# Altium schematic sheet ENET.SchDoc: ENET PHY
size 431 x 279 mm; Author: Shivam Sharma; SheetNumber: 4; SheetTotal: 14; SheetRevision: 1.0
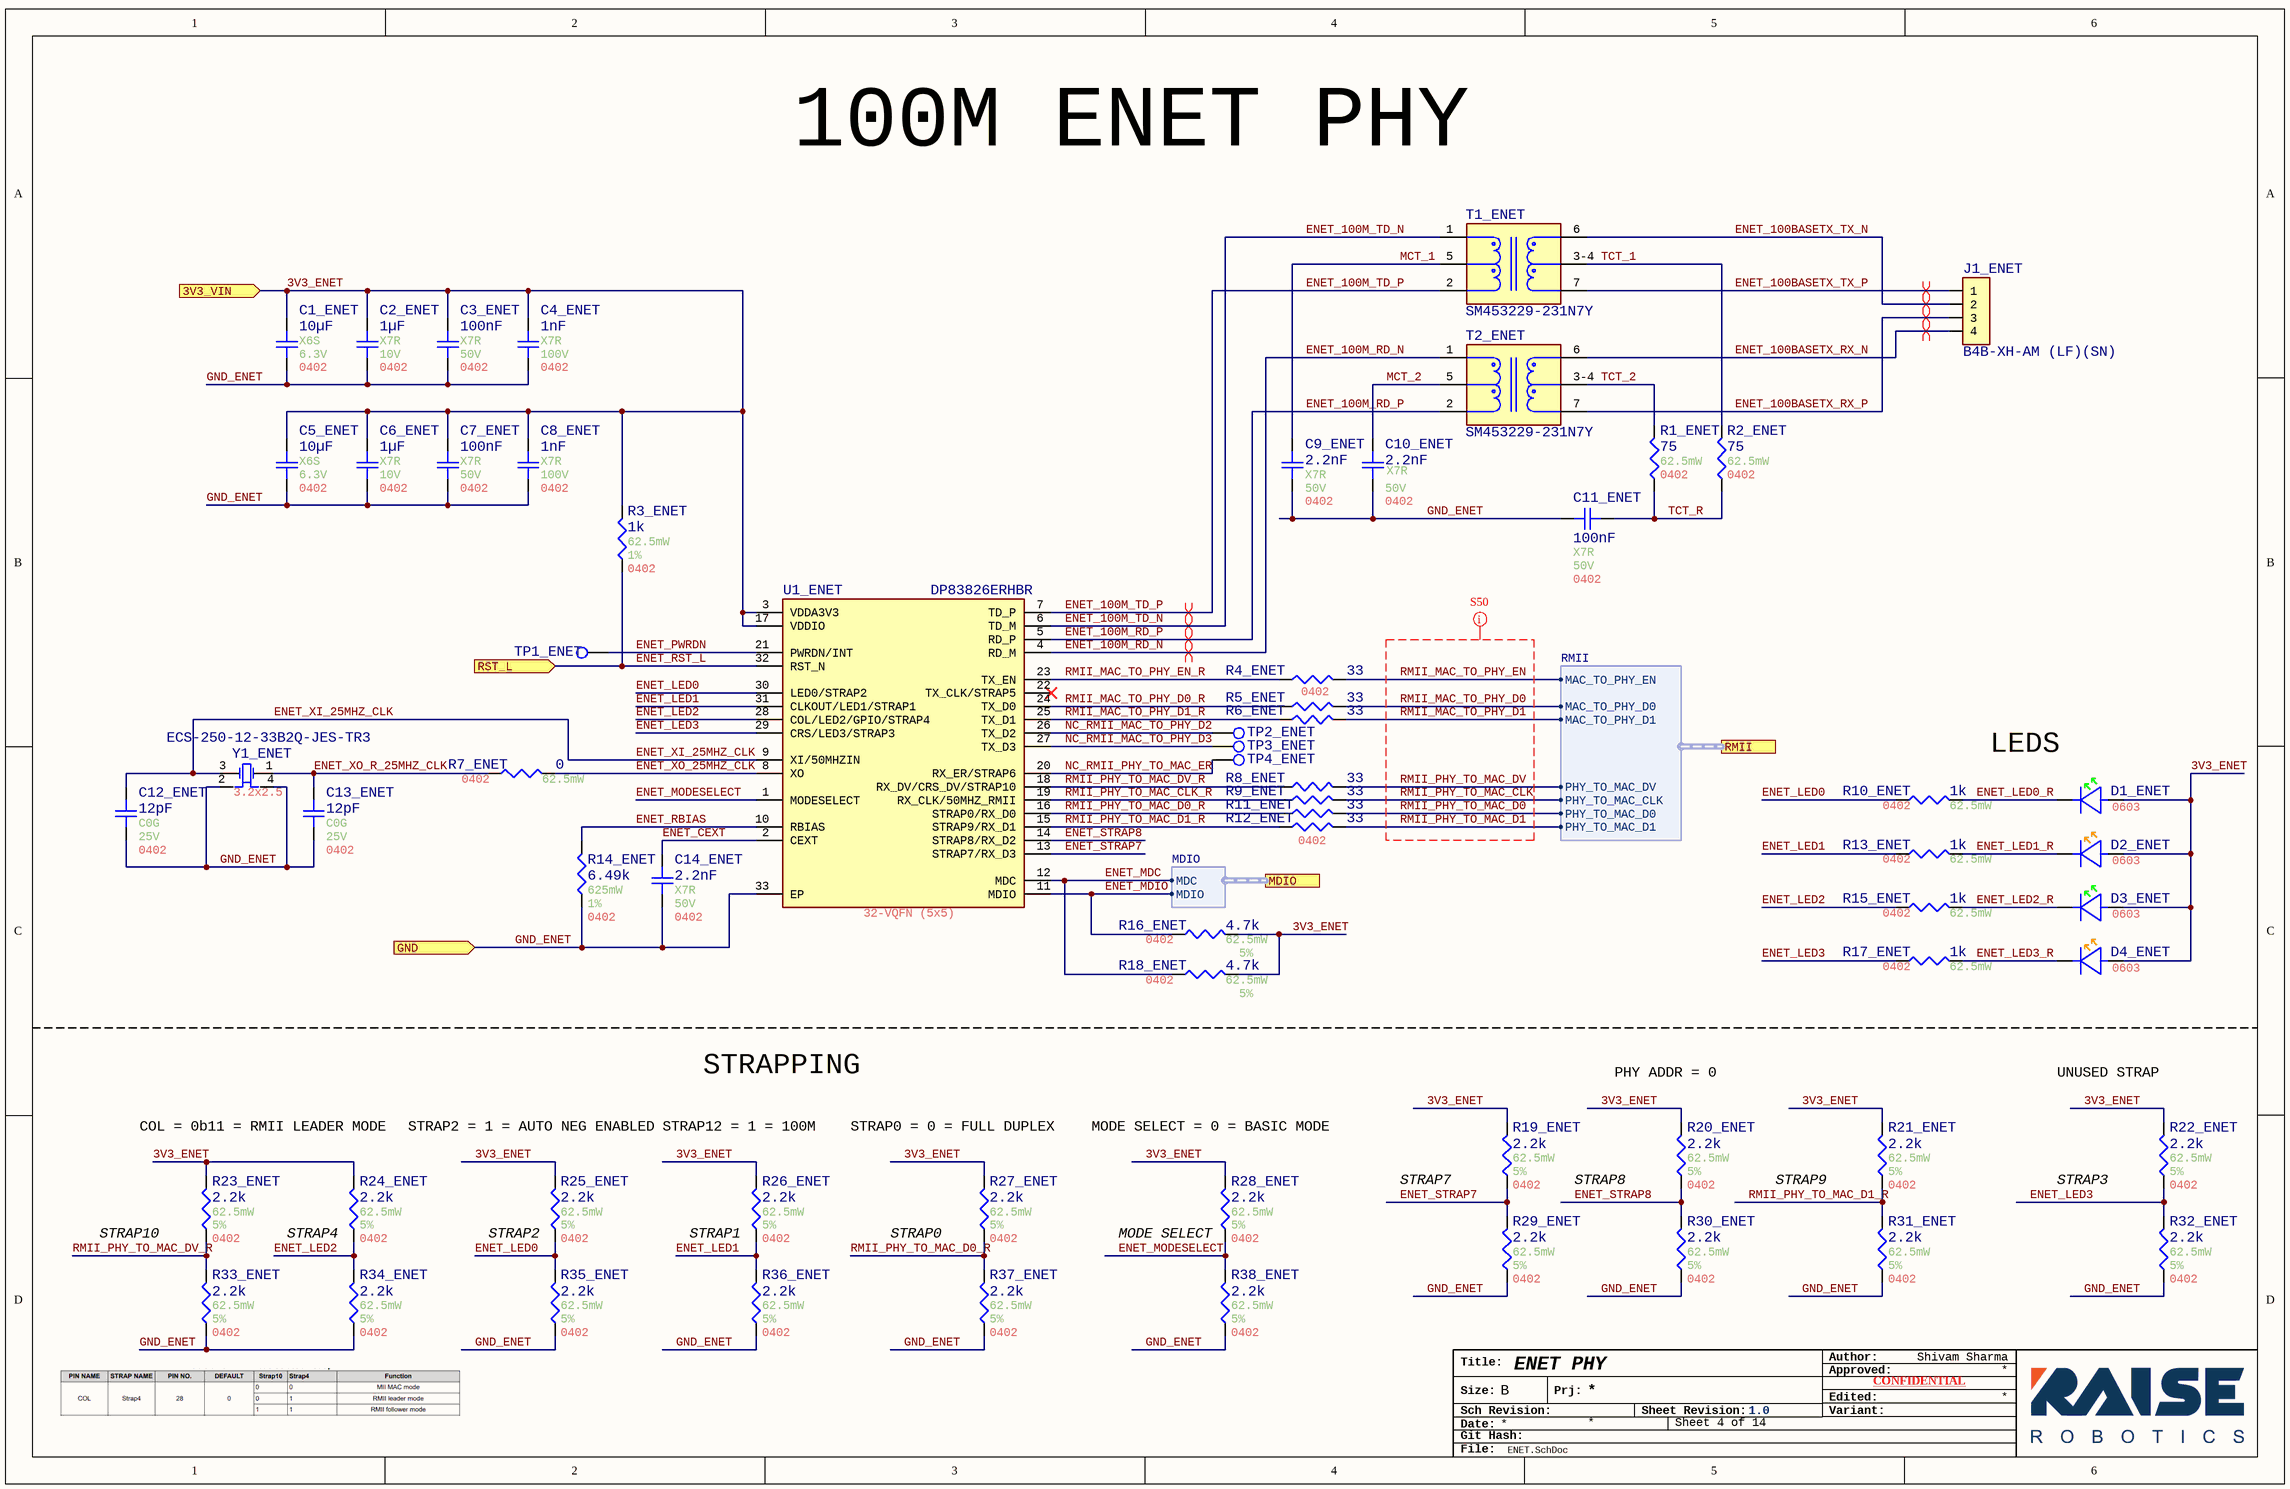
[diagram p0: ENET.SchDoc]

## Parts
C1_ENET  value 10µF  Temperature Coefficient: X6S  Voltage Rating: 6.3V  Case/Package: 0402  [Generic 0402 capacitor]  (hidden comment: GRT155C80J106ME13J)
C2_ENET  value 1µF  Temperature Coefficient: X7R  Voltage Rating: 10V  Case/Package: 0402  [Generic 0402 capacitor]  (hidden comment: MAASL105CD7105MFCA01)
C3_ENET  value 100nF  Temperature Coefficient: X7R  Voltage Rating: 50V  Case/Package: 0402  [Generic 0402 capacitor]  (hidden comment: GRT155R71H104KE01D)
C4_ENET  value 1nF  Temperature Coefficient: X7R  Voltage Rating: 100V  Case/Package: 0402  [Generic 0402 capacitor]  (hidden comment: GCM155R72A102KA37J)
C5_ENET  value 10µF  Temperature Coefficient: X6S  Voltage Rating: 6.3V  Case/Package: 0402  [Generic 0402 capacitor]  (hidden comment: GRT155C80J106ME13J)
C6_ENET  value 1µF  Temperature Coefficient: X7R  Voltage Rating: 10V  Case/Package: 0402  [Generic 0402 capacitor]  (hidden comment: MAASL105CD7105MFCA01)
C7_ENET  value 100nF  Temperature Coefficient: X7R  Voltage Rating: 50V  Case/Package: 0402  [Generic 0402 capacitor]  (hidden comment: GRT155R71H104KE01D)
C8_ENET  value 1nF  Temperature Coefficient: X7R  Voltage Rating: 100V  Case/Package: 0402  [Generic 0402 capacitor]  (hidden comment: GCM155R72A102KA37J)
C9_ENET  value 2.2nF  Temperature Coefficient: X7R  Voltage Rating: 50V  Case/Package: 0402  [Generic 0402 capacitor]  (hidden comment: CGA2B2X7R1H222K050BA)
C10_ENET  value 2.2nF  Temperature Coefficient: X7R  Voltage Rating: 50V  Case/Package: 0402  [Generic 0402 capacitor]  (hidden comment: CGA2B2X7R1H222K050BA)
C11_ENET  value 100nF  Temperature Coefficient: X7R  Voltage Rating: 50V  Case/Package: 0402  [Generic 0402 capacitor]  (hidden comment: GRT155R71H104KE01D)
C12_ENET  value 12pF  Temperature Coefficient: C0G  Voltage Rating: 25V  Case/Package: 0402  [Generic 0402 capacitor]  (hidden comment: GRT1555C1E120JA02J)
C13_ENET  value 12pF  Temperature Coefficient: C0G  Voltage Rating: 25V  Case/Package: 0402  [Generic 0402 capacitor]  (hidden comment: GRT1555C1E120JA02J)
C14_ENET  value 2.2nF  Temperature Coefficient: X7R  Voltage Rating: 50V  Case/Package: 0402  [Generic 0402 capacitor]  (hidden comment: CGA2B2X7R1H222K050BA)
D1_ENET  Case/Package: 0603  [SML-D12P8WT86C]  (hidden comment: SML-D12P8WT86C)
D2_ENET  Case/Package: 0603  [FP-SML-D12-MFG]  (hidden comment: SML-D12D8WT86C)
D3_ENET  Case/Package: 0603  [SML-D12P8WT86C]  (hidden comment: SML-D12P8WT86C)
D4_ENET  Case/Package: 0603  [FP-SML-D12-MFG]  (hidden comment: SML-D12D8WT86C)
J1_ENET  B4B-XH-AM (LF)(SN)  [FP-B4B-XH-AM_LF_SN-MFG]
R1_ENET  value 75  Power: 62.5mW  Case/Package: 0402  [Generic 0402 Resistor]  (hidden comment: WR04X75R0FTL)
R2_ENET  value 75  Power: 62.5mW  Case/Package: 0402  [Generic 0402 Resistor]  (hidden comment: WR04X75R0FTL)
R3_ENET  value 1k  Power: 62.5mW  Tolerance: 1%  Case/Package: 0402  [Generic 0402 Resistor]  (hidden comment: WR04X1001FTL)
R4_ENET  value 33  [Generic 0402 Resistor]  (hidden comment: RMCA0402FT33R0-HP)
R5_ENET  value 33  [Generic 0402 Resistor]  (hidden comment: RMCA0402FT33R0-HP)
R6_ENET  value 33  Case/Package: 0402  [Generic 0402 Resistor]  (hidden comment: RMCA0402FT33R0-HP)
R7_ENET  value 0  Power: 62.5mW  Case/Package: 0402  [Generic 0402 Resistor]  (hidden comment: WR04X000PTL)
R8_ENET  value 33  [Generic 0402 Resistor]  (hidden comment: RMCA0402FT33R0-HP)
R9_ENET  value 33  [Generic 0402 Resistor]  (hidden comment: RMCA0402FT33R0-HP)
R10_ENET  value 1k  Power: 62.5mW  Case/Package: 0402  [Generic 0402 Resistor]  (hidden comment: WR04X1001FTL)
R11_ENET  value 33  [Generic 0402 Resistor]  (hidden comment: RMCA0402FT33R0-HP)
R12_ENET  value 33  Case/Package: 0402  [Generic 0402 Resistor]  (hidden comment: RMCA0402FT33R0-HP)
R13_ENET  value 1k  Power: 62.5mW  Case/Package: 0402  [Generic 0402 Resistor]  (hidden comment: WR04X1001FTL)
R14_ENET  value 6.49k  Power: 625mW  Tolerance: 1%  Case/Package: 0402  [Generic 0402 Resistor]  (hidden comment: AC0402FR-076K49L)
R15_ENET  value 1k  Power: 62.5mW  Case/Package: 0402  [Generic 0402 Resistor]  (hidden comment: WR04X1001FTL)
R16_ENET  value 4.7k  Power: 62.5mW  Tolerance: 5%  Case/Package: 0402  [Generic 0402 Resistor]  (hidden comment: WR04X472JTL)
R17_ENET  value 1k  Power: 62.5mW  Case/Package: 0402  [Generic 0402 Resistor]  (hidden comment: WR04X1001FTL)
R18_ENET  value 4.7k  Power: 62.5mW  Tolerance: 5%  Case/Package: 0402  [Generic 0402 Resistor]  (hidden comment: WR04X472JTL)
R19_ENET  value 2.2k  Power: 62.5mW  Tolerance: 5%  Case/Package: 0402  [Generic 0402 Resistor]  (hidden comment: CR0402-JW-222GLF)
R20_ENET  value 2.2k  Power: 62.5mW  Tolerance: 5%  Case/Package: 0402  [Generic 0402 Resistor]  (hidden comment: CR0402-JW-222GLF)
R21_ENET  value 2.2k  Power: 62.5mW  Tolerance: 5%  Case/Package: 0402  [Generic 0402 Resistor]  (hidden comment: CR0402-JW-222GLF)
R22_ENET  value 2.2k  Power: 62.5mW  Tolerance: 5%  Case/Package: 0402  [Generic 0402 Resistor]  (hidden comment: CR0402-JW-222GLF)
R23_ENET  value 2.2k  Power: 62.5mW  Tolerance: 5%  Case/Package: 0402  [Generic 0402 Resistor]  (hidden comment: CR0402-JW-222GLF)
R24_ENET  value 2.2k  Power: 62.5mW  Tolerance: 5%  Case/Package: 0402  [Generic 0402 Resistor]  (hidden comment: CR0402-JW-222GLF)
R25_ENET  value 2.2k  Power: 62.5mW  Tolerance: 5%  Case/Package: 0402  [Generic 0402 Resistor]  (hidden comment: CR0402-JW-222GLF)
R26_ENET  value 2.2k  Power: 62.5mW  Tolerance: 5%  Case/Package: 0402  [Generic 0402 Resistor]  (hidden comment: CR0402-JW-222GLF)
R27_ENET  value 2.2k  Power: 62.5mW  Tolerance: 5%  Case/Package: 0402  [Generic 0402 Resistor]  (hidden comment: CR0402-JW-222GLF)
R28_ENET  value 2.2k  Power: 62.5mW  Tolerance: 5%  Case/Package: 0402  [Generic 0402 Resistor]  (hidden comment: CR0402-JW-222GLF)
R29_ENET  value 2.2k  Power: 62.5mW  Tolerance: 5%  Case/Package: 0402  [Generic 0402 Resistor]  (hidden comment: CR0402-JW-222GLF)
R30_ENET  value 2.2k  Power: 62.5mW  Tolerance: 5%  Case/Package: 0402  [Generic 0402 Resistor]  (hidden comment: CR0402-JW-222GLF)
R31_ENET  value 2.2k  Power: 62.5mW  Tolerance: 5%  Case/Package: 0402  [Generic 0402 Resistor]  (hidden comment: CR0402-JW-222GLF)
R32_ENET  value 2.2k  Power: 62.5mW  Tolerance: 5%  Case/Package: 0402  [Generic 0402 Resistor]  (hidden comment: CR0402-JW-222GLF)
R33_ENET  value 2.2k  Power: 62.5mW  Tolerance: 5%  Case/Package: 0402  [Generic 0402 Resistor]  (hidden comment: CR0402-JW-222GLF)
R34_ENET  value 2.2k  Power: 62.5mW  Tolerance: 5%  Case/Package: 0402  [Generic 0402 Resistor]  (hidden comment: CR0402-JW-222GLF)
R35_ENET  value 2.2k  Power: 62.5mW  Tolerance: 5%  Case/Package: 0402  [Generic 0402 Resistor]  (hidden comment: CR0402-JW-222GLF)
R36_ENET  value 2.2k  Power: 62.5mW  Tolerance: 5%  Case/Package: 0402  [Generic 0402 Resistor]  (hidden comment: CR0402-JW-222GLF)
R37_ENET  value 2.2k  Power: 62.5mW  Tolerance: 5%  Case/Package: 0402  [Generic 0402 Resistor]  (hidden comment: CR0402-JW-222GLF)
R38_ENET  value 2.2k  Power: 62.5mW  Tolerance: 5%  Case/Package: 0402  [Generic 0402 Resistor]  (hidden comment: CR0402-JW-222GLF)
T1_ENET  SM453229-231N7Y  [SM453229-231N7Y]
T2_ENET  SM453229-231N7Y  [SM453229-231N7Y]
TP1_ENET  TP 0.75mm  [TP 0.75mm]  (value not drawn)  (no BOM)
TP2_ENET  TP 0.75mm  [TP 0.75mm]  (value not drawn)  (no BOM)
TP3_ENET  TP 0.75mm  [TP 0.75mm]  (value not drawn)  (no BOM)
TP4_ENET  TP 0.75mm  [TP 0.75mm]  (value not drawn)  (no BOM)
U1_ENET  DP83826ERHBR  Case/Package: 32-VQFN (5x5)  [DP83826ERHBR]
Y1_ENET  ECS-250-12-33B2Q-JES-TR3  Case/Package: 3.2x2.5  [ECS-250-12-33B2Q-JES-TR3]

## Ports
3V3_VIN (in), GND (in), MDIO (harness MDIO), RMII (harness RMII), RST_L (in)

## Harnesses
MDIO: MDIO, MDC
RMII: MAC_TO_PHY_D0, MAC_TO_PHY_D1, PHY_TO_MAC_D0, PHY_TO_MAC_CLK, PHY_TO_MAC_D1, MAC_TO_PHY_EN, PHY_TO_MAC_DV

## Nets
3V3_ENET: C1_ENET.2 C2_ENET.2 C3_ENET.2 C4_ENET.2 C5_ENET.2 C6_ENET.2 C7_ENET.2 C8_ENET.2 D1_ENET.2(A) D2_ENET.2(A) D3_ENET.2(A) D4_ENET.2(A) R3_ENET.2 R16_ENET.2 R18_ENET.2 R19_ENET.2 R20_ENET.2 R21_ENET.2 R22_ENET.2 R23_ENET.2 R24_ENET.2 R25_ENET.2 R26_ENET.2 R27_ENET.2 R28_ENET.2 U1_ENET.3(VDDA3V3) U1_ENET.17(VDDIO) ; port 3V3_VIN
ENET_100BASETX_RX_N: J1_ENET.4 T2_ENET.6
ENET_100BASETX_RX_P: J1_ENET.3 T2_ENET.7
ENET_100BASETX_TX_N: J1_ENET.2 T1_ENET.6
ENET_100BASETX_TX_P: J1_ENET.1 T1_ENET.7
ENET_100M_RD_N: T2_ENET.1 U1_ENET.4(RD_M)
ENET_100M_RD_P: T2_ENET.2 U1_ENET.5(RD_P)
ENET_100M_TD_N: T1_ENET.1 U1_ENET.6(TD_M)
ENET_100M_TD_P: T1_ENET.2 U1_ENET.7(TD_P)
ENET_CEXT: C14_ENET.2 U1_ENET.2(CEXT)
ENET_LED0: R10_ENET.1 R25_ENET.1 R35_ENET.2 U1_ENET.30(LED0/STRAP2)
ENET_LED0_R: D1_ENET.1(C) R10_ENET.2
ENET_LED1: R13_ENET.1 R26_ENET.1 R36_ENET.2 U1_ENET.31(CLKOUT/LED1/STRAP1)
ENET_LED1_R: D2_ENET.1(C) R13_ENET.2
ENET_LED2: R15_ENET.1 R24_ENET.1 R34_ENET.2 U1_ENET.28(COL/LED2/GPIO/STRAP4)
ENET_LED2_R: D3_ENET.1(C) R15_ENET.2
ENET_LED3: R17_ENET.1 R22_ENET.1 R32_ENET.2 U1_ENET.29(CRS/LED3/STRAP3)
ENET_LED3_R: D4_ENET.1(C) R17_ENET.2
ENET_MDC: R18_ENET.1 U1_ENET.12(MDC) ; port MDIO.MDC
ENET_MDIO: R16_ENET.1 U1_ENET.11(MDIO) ; port MDIO.MDIO
ENET_MODESELECT: R28_ENET.1 R38_ENET.2 U1_ENET.1(MODESELECT)
ENET_PWRDN: TP1_ENET.1 U1_ENET.21(PWRDN/INT)
ENET_RBIAS: R14_ENET.2 U1_ENET.10(RBIAS)
ENET_RST_L: R3_ENET.1 U1_ENET.32(RST_N) ; port RST_L
ENET_STRAP7: R19_ENET.1 R29_ENET.2 U1_ENET.13(STRAP7/RX_D3)
ENET_STRAP8: R20_ENET.1 R30_ENET.2 U1_ENET.14(STRAP8/RX_D2)
ENET_XI_25MHZ_CLK: C12_ENET.2 U1_ENET.9(XI/50MHZIN) Y1_ENET.3
ENET_XO_25MHZ_CLK: R7_ENET.2 U1_ENET.8(XO)
ENET_XO_R_25MHZ_CLK: C13_ENET.2 R7_ENET.1 Y1_ENET.1
GND_ENET: C1_ENET.1 C2_ENET.1 C3_ENET.1 C4_ENET.1 C5_ENET.1 C6_ENET.1 C7_ENET.1 C8_ENET.1 C9_ENET.1 C10_ENET.1 C11_ENET.2 C12_ENET.1 C13_ENET.1 C14_ENET.1 R14_ENET.1 R29_ENET.1 R30_ENET.1 R31_ENET.1 R32_ENET.1 R33_ENET.1 R34_ENET.1 R35_ENET.1 R36_ENET.1 R37_ENET.1 R38_ENET.1 U1_ENET.33(EP) Y1_ENET.2 Y1_ENET.4 ; port GND
MCT_1: C9_ENET.2 T1_ENET.5
MCT_2: C10_ENET.2 T2_ENET.5
NC_RMII_MAC_TO_PHY_D2: TP2_ENET.1 U1_ENET.26(TX_D2)
NC_RMII_MAC_TO_PHY_D3: TP3_ENET.1 U1_ENET.27(TX_D3)
NC_RMII_PHY_TO_MAC_ER: TP4_ENET.1 U1_ENET.20(RX_ER/STRAP6)
RMII_MAC_TO_PHY_D0: R5_ENET.2 ; port RMII.MAC_TO_PHY_D0
RMII_MAC_TO_PHY_D0_R: R5_ENET.1 U1_ENET.24(TX_D0)
RMII_MAC_TO_PHY_D1: R6_ENET.2 ; port RMII.MAC_TO_PHY_D1
RMII_MAC_TO_PHY_D1_R: R6_ENET.1 U1_ENET.25(TX_D1)
RMII_MAC_TO_PHY_EN: R4_ENET.2 ; port RMII.MAC_TO_PHY_EN
RMII_MAC_TO_PHY_EN_R: R4_ENET.1 U1_ENET.23(TX_EN)
RMII_PHY_TO_MAC_CLK: R9_ENET.2 ; port RMII.PHY_TO_MAC_CLK
RMII_PHY_TO_MAC_CLK_R: R9_ENET.1 U1_ENET.19(RX_CLK/50MHZ_RMII)
RMII_PHY_TO_MAC_D0: R11_ENET.2 ; port RMII.PHY_TO_MAC_D0
RMII_PHY_TO_MAC_D0_R: R11_ENET.1 R27_ENET.1 R37_ENET.2 U1_ENET.16(STRAP0/RX_D0)
RMII_PHY_TO_MAC_D1: R12_ENET.2 ; port RMII.PHY_TO_MAC_D1
RMII_PHY_TO_MAC_D1_R: R12_ENET.1 R21_ENET.1 R31_ENET.2 U1_ENET.15(STRAP9/RX_D1)
RMII_PHY_TO_MAC_DV: R8_ENET.2 ; port RMII.PHY_TO_MAC_DV
RMII_PHY_TO_MAC_DV_R: R8_ENET.1 R23_ENET.1 R33_ENET.2 U1_ENET.18(RX_DV/CRS_DV/STRAP10)
TCT_1: R2_ENET.2 T1_ENET.3-4
TCT_2: R1_ENET.2 T2_ENET.3-4
TCT_R: C11_ENET.1 R1_ENET.1 R2_ENET.1

Not connected (* = marked no-connect by the designer): U1_ENET 22(TX_CLK/STRAP5)*

## Layout directives
differential pair: ENET_100BASETX_RX_N, ENET_100BASETX_RX_P, ENET_100BASETX_TX_N, ENET_100BASETX_TX_P, ENET_100M_RD_N, ENET_100M_RD_P, ENET_100M_TD_N, ENET_100M_TD_P
net class S50: RMII_MAC_TO_PHY_D0, RMII_MAC_TO_PHY_D1, RMII_MAC_TO_PHY_EN, RMII_PHY_TO_MAC_CLK, RMII_PHY_TO_MAC_D0, RMII_PHY_TO_MAC_D1, RMII_PHY_TO_MAC_DV

## Notes on the sheet
- 100M ENET PHY
- LEDS
- STRAPPING
- PHY ADDR = 0
- UNUSED STRAP
- COL = 0b11 = RMII LEADER MODE
- STRAP2 = 1 = AUTO NEG ENABLED
- STRAP12 = 1 = 100M
- STRAP0 = 0 = FULL DUPLEX
- MODE SELECT = 0 = BASIC MODE
- STRAP10
- (near R24_ENET) STRAP4
- (near R25_ENET) STRAP2
- (near R26_ENET) STRAP1
- STRAP0
- (near R28_ENET) MODE SELECT
- STRAP7
- STRAP8
- STRAP9
- STRAP3
- Title:
- Author:
- Approved:
- Size:
- Date:
- Git Hash:
- Sch Revision:
- B
- Prj:
- Sheet Revision:
- Variant:
- Edited:
- CONFIDENTIAL
- File:

## Library data of the parts
C1_ENET C5_ENET = CMP-001-00108-2: Multilayer Ceramic Capacitors MLCC - SMD/SMT 0402 10uF 6.3VDC 20% X6S AEC-Q200; AECQ: Yes; Mounting Technology: Surface Mount; Max Operating Temperature: 105°C; Min Operating Temperature: -55°C; Tolerance: 20%; Pins: 2; RoHS Compliant: Yes; Capacitor Type: Ceramic
C2_ENET C6_ENET = CMP-001-00104-2: Cap Cer 1UF 20V X7T 0402; Capacitor Type: Ceramic; AECQ: Yes; Tolerance: 20%; Max Operating Temperature: 125°C; Min Operating Temperature: -55°C; Mounting Technology: Surface Mount; RoHS Compliant: Yes; Pins: 2
C3_ENET C7_ENET C11_ENET = CMP-001-00084-12: Ceramic Capacitor, Multilayer, Ceramic, 50V, 10% +Tol, 10% -Tol, X7R, 15% TC, 0.1uF, Surface Mount, 0402; AECQ: Yes; Reach SVHC Compliant: Yes; Mounting Technology: Surface Mount; Termination: Wraparound; Pins: 2; Packaging: Tape and Reel; Package Shape: Rectangular; Multilayer: Yes; Tolerance: 10%; Max Operating Temperature: 125°C; Terminal Finish: Nickel; Capacitor Type: Ceramic; Dielectric Material: Ceramic; Min Operating Temperature: -55°C; RoHS Compliant: Yes
C4_ENET C8_ENET = CMP-001-00101-2: Ceramic Capacitor, Multilayer, Ceramic, 100V, 10% +Tol, 10% -Tol, X7R, 15% TC, 0.001uF, Surface Mount, 0402; AECQ: Yes; Pins: 2; Tolerance: 10%; Max Operating Temperature: 125°C; Capacitor Type: Ceramic; Mounting Technology: SMD; Min Operating Temperature: -55°C
C9_ENET C10_ENET C14_ENET = CMP-001-00093-4: 50V 2.2nF X7R 卤10% 0402 Multilayer Ceramic Capacitors MLCC - SMD/SMT ROHS; Multilayer: Yes; Tolerance: 10%; Max Operating Temperature: 150°C; AECQ: Yes; Reach SVHC Compliant: Yes; Package Shape: Rectangular; Dielectric Material: Ceramic; Min Operating Temperature: -55°C; Packaging: Tape and Reel; RoHS Compliant: Yes; Capacitor Type: Ceramic; Mounting Technology: Surface Mount; Pins: 2
C12_ENET C13_ENET = CMP-001-00109-2: Ceramic Capacitor, Multilayer, Ceramic, 25V, 5% +Tol, 5% -Tol, C0G, 30ppm/Cel TC, 0.000012uF, Surface Mount, 0402; AECQ: Yes; Pins: 2; Mounting Technology: Surface Mount; Min Operating Temperature: -55°C; RoHS Compliant: Yes; Max Operating Temperature: 125°C; Tolerance: 5%; Capacitor Type: Ceramic
D1_ENET D3_ENET = CMP-007-00039-1: Green 560nm LED Indication - Discrete 2.2V 0603 (1608 Metric); Forward Voltage: 2.2V; Pins: 2; Colour: Green
D2_ENET D4_ENET = CMP-007-00038-1: Orange 605nm LED Indication - Discrete 2.2V 0603 (1608 Metric); Colour: Orange; Forward Voltage: 2.2V; Pins: 2
J1_ENET = CMP-002-00133-1: Header, Xh, Top, 4Way, 2.5Mm, Boss;; Manufacturer: JST; Max Current Rating: 3A; Gender: Male; Pitch: 2.4892mm; Voltage Rating: 250V; Length: 12.4mm; Min Operating Temperature: -25°C; Max Operating Temperature: 85°C; Pins: 4; Manufacturer Series: XH; Case/Package: THT; Height: 7mm; Connector Type: Header
R1_ENET R2_ENET = CMP-009-00181-8: Fixed Resistor, Metal Glaze/thick Film, 0.0625W, 75ohm, 50V, 1% +/-Tol, 100ppm/Cel, Surface Mount, 0402; Manufacturer Part Number: Blank; Package Height: 0.35mm; AECQ: No; Package Length: 1mm; Rated Temperature: 70°C; Package Width: 0.5mm; Temperature Coefficient (ppm/Cel): 100; Additional Feature: LASER TRIMMABLE; Tolerance: 1%; Terminal Finish: Nickel; Construction: Chip; Resistor Type: FIXED RESISTOR; Max Operating Temperature: 155°C; Technology: METAL GLAZE/THICK FILM; Min Operating Temperature: -55°C; Package Shape: Rectangular; JESD-609 Code: e3; Working Voltage: 50V; RoHS Compliant: Yes; Packaging: Tape and Reel; Reach SVHC Compliant: Yes; Termination: Wraparound; Mounting Technology: Surface Mount; Pins: 2
R3_ENET R10_ENET R13_ENET R15_ENET R17_ENET = CMP-009-00182-8: Fixed Resistor, Metal Glaze/thick Film, 0.0625W, 1000ohm, 50V, 1% +/-Tol, 100ppm/Cel, Surface Mount, 0402; Manufacturer Part Number: Blank; Package Width: 0.5mm; Rated Temperature: 70°C; AECQ: No; Package Length: 1mm; Additional Feature: LASER TRIMMABLE; Package Height: 0.35mm; Temperature Coefficient (ppm/Cel): 100; RoHS Compliant: Yes; Working Voltage: 50V; Min Operating Temperature: -55°C; Pins: 2; Reach SVHC Compliant: Yes; Technology: METAL GLAZE/THICK FILM; Terminal Finish: Nickel; Max Operating Temperature: 155°C; Resistor Type: FIXED RESISTOR; Package Shape: Rectangular; Mounting Technology: Surface Mount; Termination: Wraparound; JESD-609 Code: e3; Packaging: Tape and Reel; Construction: Chip
  R10_ENET R13_ENET R15_ENET R17_ENET: Tolerance: 1%
R4_ENET R5_ENET R6_ENET R8_ENET R9_ENET R11_ENET R12_ENET = CMP-009-00205-4: Fixed Resistor, Metal Glaze/thick Film, 0.1W, 33ohm, 50V, 1% +/-Tol, 100ppm/Cel, Surface Mount, 0402; Power: 625mW; AECQ: Yes; Tolerance: 1%; Max Operating Temperature: 155°C; Pins: 2; Min Operating Temperature: -55°C; Voltage Rating: 50V; Mounting Technology: SMD
  R4_ENET R5_ENET R8_ENET R9_ENET R11_ENET: Case/Package: 0402
R7_ENET = CMP-009-00186-8: Fixed Resistor, Metal Glaze/thick Film, 0.0625W, 0ohm, Surface Mount, 0402; Manufacturer Part Number: Blank; Tolerance: 0%; AECQ: No; Package Width: 0.5mm; Rated Temperature: 70°C; Package Height: 0.35mm; Package Length: 1mm; Mounting Technology: Surface Mount; Resistor Type: FIXED RESISTOR; Packaging: Tape and Reel; Pins: 2; JESD-609 Code: e3; RoHS Compliant: Yes; Termination: Wraparound; Construction: Chip; Technology: METAL GLAZE/THICK FILM; Package Shape: Rectangular; Max Operating Temperature: 155°C; Terminal Finish: Nickel; Min Operating Temperature: -55°C; Reach SVHC Compliant: Yes
R14_ENET = CMP-009-00204-3: Fixed Resistor, Metal Glaze/thick Film, 0.0625W, 6490ohm, 50V, 1% +/-Tol, 100ppm/Cel, Surface Mount, 0402; AECQ: Yes; Min Operating Temperature: -55°C; Max Operating Temperature: 155°C; Pins: 2; Mounting Technology: SMD
R16_ENET R18_ENET = CMP-009-00184-8: Fixed Resistor, Metal Glaze/thick Film, 0.0625W, 4700ohm, 50V, 5% +/-Tol, 100ppm/Cel, Surface Mount, 0402; Manufacturer Part Number: Blank; Package Height: 0.35mm; Package Length: 1mm; Rated Temperature: 70°C; Package Width: 0.5mm; AECQ: No; Temperature Coefficient (ppm/Cel): 200; Additional Feature: LASER TRIMMABLE; Mounting Technology: Surface Mount; Technology: METAL GLAZE/THICK FILM; RoHS Compliant: Yes; Resistor Type: FIXED RESISTOR; Package Shape: Rectangular; Pins: 2; Construction: Chip; Terminal Finish: Nickel; Max Operating Temperature: 155°C; Working Voltage: 50V; Packaging: Tape and Reel; Termination: Wraparound; JESD-609 Code: e3; Reach SVHC Compliant: Yes; Min Operating Temperature: -55°C
R19_ENET R20_ENET R21_ENET R22_ENET R23_ENET R24_ENET R25_ENET R26_ENET R27_ENET R28_ENET R29_ENET R30_ENET R31_ENET R32_ENET R33_ENET R34_ENET R35_ENET R36_ENET R37_ENET R38_ENET = CMP-009-00183-8: Fixed Resistor, Metal Glaze/thick Film, 0.0625W, 2200ohm, 50V, 5% +/-Tol, 200ppm/Cel, Surface Mount, 0402; Manufacturer Part Number: Blank; Package Width: 0.5mm; Rated Temperature: 70°C; AECQ: No; Package Length: 1mm; Package Height: 0.35mm; Temperature Coefficient (ppm/Cel): 200; RoHS Compliant: Yes; Working Voltage: 50V; Min Operating Temperature: -55°C; Pins: 2; Reach SVHC Compliant: No; Technology: RUTHENIUM OXIDE; Terminal Finish: Nickel; Max Operating Temperature: 125°C; Resistor Type: FIXED RESISTOR; Package Shape: Rectangular; Mounting Technology: Surface Mount; Termination: Wraparound; JESD-609 Code: e3; Packaging: Tape and Reel; Construction: Chip
T1_ENET T2_ENET = CMP-00000-3: CHIP LAN,10/100/1G XFORMER,POE,4; RoHS Compliant: Yes
TP1_ENET TP2_ENET TP3_ENET TP4_ENET = CMP-00009-1: 0.75mm circular test point; Size: 0.75mm
U1_ENET = CMP-031-00009-2: Ethernet Transceiver, 1-Trnsvr, PQCC32; AECQ: No; Max Operating Temperature: 105°C; Min Operating Temperature: -40°C; Pins: 32; MPN: DP83826ERHBR
Y1_ENET = CMP-003-00030-1: Crystal 25.000 Mhz 12PF SMD; AECQ: Yes; ESR: 50; Frequency: 25MHz; Mounting Technology: SMD; Min Operating Temperature: -40°C; Load Capacitance: 12pF; Pins: 4; Max Operating Temperature: 125°C